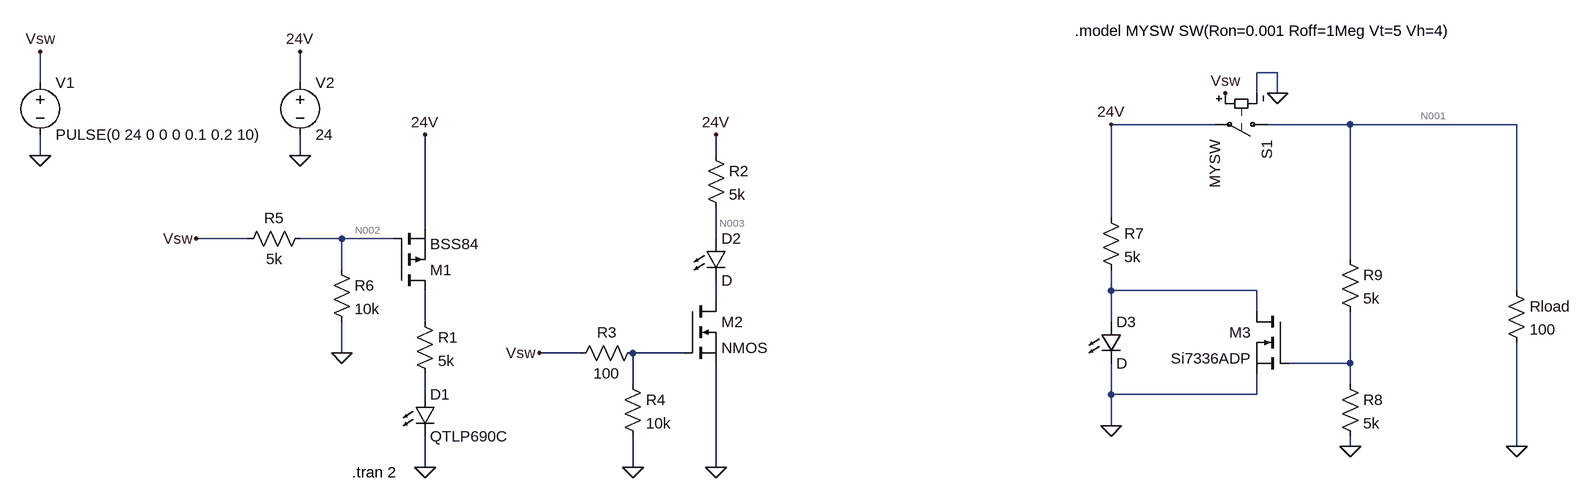
[diagram p0: schematic PMOS_OPEN_CKT_DETECT.asc]
PMOS_OPEN_CKT_DETECT.asc, the LTspice schematic file:
Version 4
SHEET 1 1768 680
WIRE 1312 -464 1280 -464
WIRE -592 -448 -592 -496
WIRE -192 -448 -192 -496
WIRE 1280 -432 1280 -464
WIRE 1312 -432 1312 -464
WIRE 1216 -384 1056 -384
WIRE 1424 -384 1296 -384
WIRE 1680 -384 1424 -384
WIRE -592 -336 -592 -368
WIRE -192 -336 -192 -368
WIRE 448 -336 448 -368
WIRE 1056 -240 1056 -384
WIRE 0 -224 0 -368
WIRE -272 -208 -352 -208
WIRE -128 -208 -192 -208
WIRE -48 -208 -128 -208
WIRE 448 -208 448 -256
WIRE 1424 -176 1424 -384
WIRE -128 -160 -128 -208
WIRE 1056 -128 1056 -160
WIRE 1280 -128 1056 -128
WIRE 1680 -128 1680 -384
WIRE 448 -112 448 -144
WIRE 1280 -96 1280 -128
WIRE 0 -80 0 -128
WIRE 1056 -80 1056 -128
WIRE -128 -32 -128 -80
WIRE 240 -32 176 -32
WIRE 400 -32 320 -32
WIRE 1424 -16 1424 -96
WIRE 1424 -16 1328 -16
WIRE 320 16 320 -32
WIRE 1424 16 1424 -16
WIRE 0 32 0 0
WIRE 1056 32 1056 -16
WIRE 1280 32 1280 0
WIRE 1280 32 1056 32
WIRE 1056 80 1056 32
WIRE 1424 112 1424 96
WIRE 1680 112 1680 -48
WIRE 0 144 0 96
WIRE 320 144 320 96
WIRE 448 144 448 -16
FLAG 0 144 0
FLAG 448 144 0
FLAG 448 -368 24V
FLAG 320 144 0
FLAG -128 -32 0
FLAG 176 -32 Vsw
FLAG -592 -336 0
FLAG -192 -336 0
FLAG -192 -496 24V
FLAG -592 -496 Vsw
FLAG -352 -208 Vsw
FLAG 0 -368 24V
FLAG 1056 80 0
FLAG 1312 -432 0
FLAG 1232 -432 Vsw
FLAG 1680 112 0
FLAG 1424 112 0
FLAG 1056 -384 24V
SYMBOL pmos -48 -128 M180
SYMATTR InstName M1
SYMATTR Value BSS84
SYMBOL nmos 400 -112 R0
SYMATTR InstName M2
SYMBOL res -16 -96 R0
SYMATTR InstName R1
SYMATTR Value 5k
SYMBOL LED -16 32 R0
SYMATTR InstName D1
SYMATTR Value QTLP690C
SYMBOL res 432 -352 R0
SYMATTR InstName R2
SYMATTR Value 5k
SYMBOL LED 432 -208 R0
SYMATTR InstName D2
SYMBOL res 224 -16 R270
WINDOW 0 32 56 VTop 2
WINDOW 3 0 56 VBottom 2
SYMATTR InstName R3
SYMATTR Value 100
SYMBOL res 304 0 R0
SYMATTR InstName R4
SYMATTR Value 10k
SYMBOL res -288 -192 R270
WINDOW 0 32 56 VTop 2
WINDOW 3 0 56 VBottom 2
SYMATTR InstName R5
SYMATTR Value 5k
SYMBOL res -144 -176 R0
SYMATTR InstName R6
SYMATTR Value 10k
SYMBOL voltage -592 -464 R0
WINDOW 123 0 0 Left 0
WINDOW 39 0 0 Left 0
SYMATTR InstName V1
SYMATTR Value PULSE(0 24 0 0 0 0.1 0.2 10)
SYMBOL voltage -192 -464 R0
WINDOW 123 0 0 Left 0
WINDOW 39 0 0 Left 0
SYMATTR InstName V2
SYMATTR Value 24
SYMBOL nmos 1328 -96 M0
SYMATTR InstName M3
SYMATTR Value Si7336ADP
SYMBOL LED 1040 -80 R0
SYMATTR InstName D3
SYMBOL res 1040 -256 R0
SYMATTR InstName R7
SYMATTR Value 5k
SYMBOL res 1408 0 R0
SYMATTR InstName R8
SYMATTR Value 5k
SYMBOL sw 1312 -384 R90
SYMATTR InstName S1
SYMATTR Value MYSW
SYMBOL res 1664 -144 R0
SYMATTR InstName Rload
SYMATTR Value 100
SYMBOL res 1408 -192 R0
SYMATTR InstName R9
SYMATTR Value 5k
TEXT -112 152 Left 2 !.tran 2
TEXT 1000 -528 Left 2 !.model MYSW SW(Ron=0.001 Roff=1Meg Vt=5 Vh=4)

The netlist it stands for:
* PMOS_OPEN_CKT_DETECT.asc
M1 N006 N002 24V 24V BSS84
M2 N005 N007 0 0 NMOS
R1 N006 N009 5k
D1 N009 0 QTLP690C
R2 24V N003 5k
D2 N003 N005 D
R3 Vsw N007 100
R4 N007 0 10k
R5 Vsw N002 5k
R6 N002 0 10k
V1 Vsw 0 PULSE(0 24 0 0 0 0.1 0.2 10)
V2 24V 0 24
M3 N004 N008 0 0 Si7336ADP
D3 N004 0 D
R7 24V N004 5k
R8 N008 0 5k
S1 N001 24V Vsw 0 MYSW
Rload N001 0 100
R9 N001 N008 5k
.model D D
.lib standard.dio
.model NMOS NMOS
.model PMOS PMOS
.lib standard.mos
.tran 2
.model MYSW SW(Ron=0.001 Roff=1Meg Vt=5 Vh=4)
.backanno
.end

* Results of the author's LTspice run, read from the files saved beside the schematic
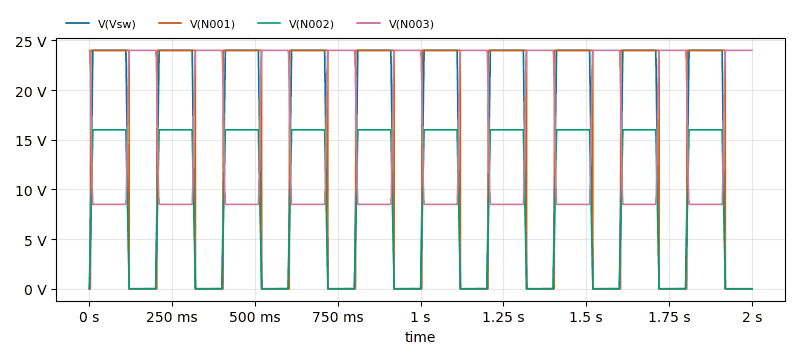
[diagram p1: Transient Analysis of PMOS_OPEN_CKT_DETECT.asc, plotted from the saved traces]
* Transient Analysis, 1 run:
*   V(Vsw): min 0 V, max 24 V, average 13.2 V, rms 17.53 V, last 0 V
*   V(N001): min 2.376 mV, max 24 V, average 13.91 V, rms 18.26 V, last 2.376 mV
*   V(N002): min 0 V, max 16 V, average 8.8 V, rms 11.69 V, last 0 V
*   V(N003): min 8.493 V, max 24 V, average 15.51 V, rms 17.24 V, last 24 V